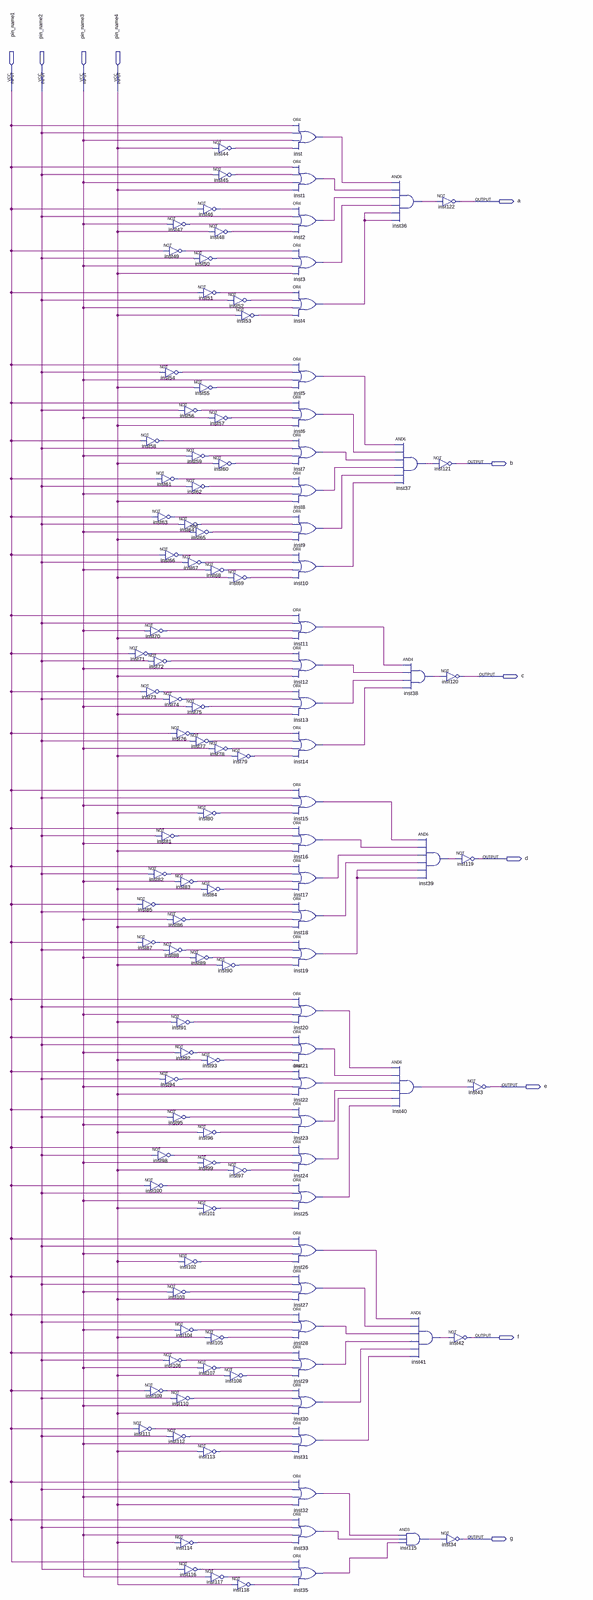
[diagram p0: schematic sheet, whole]
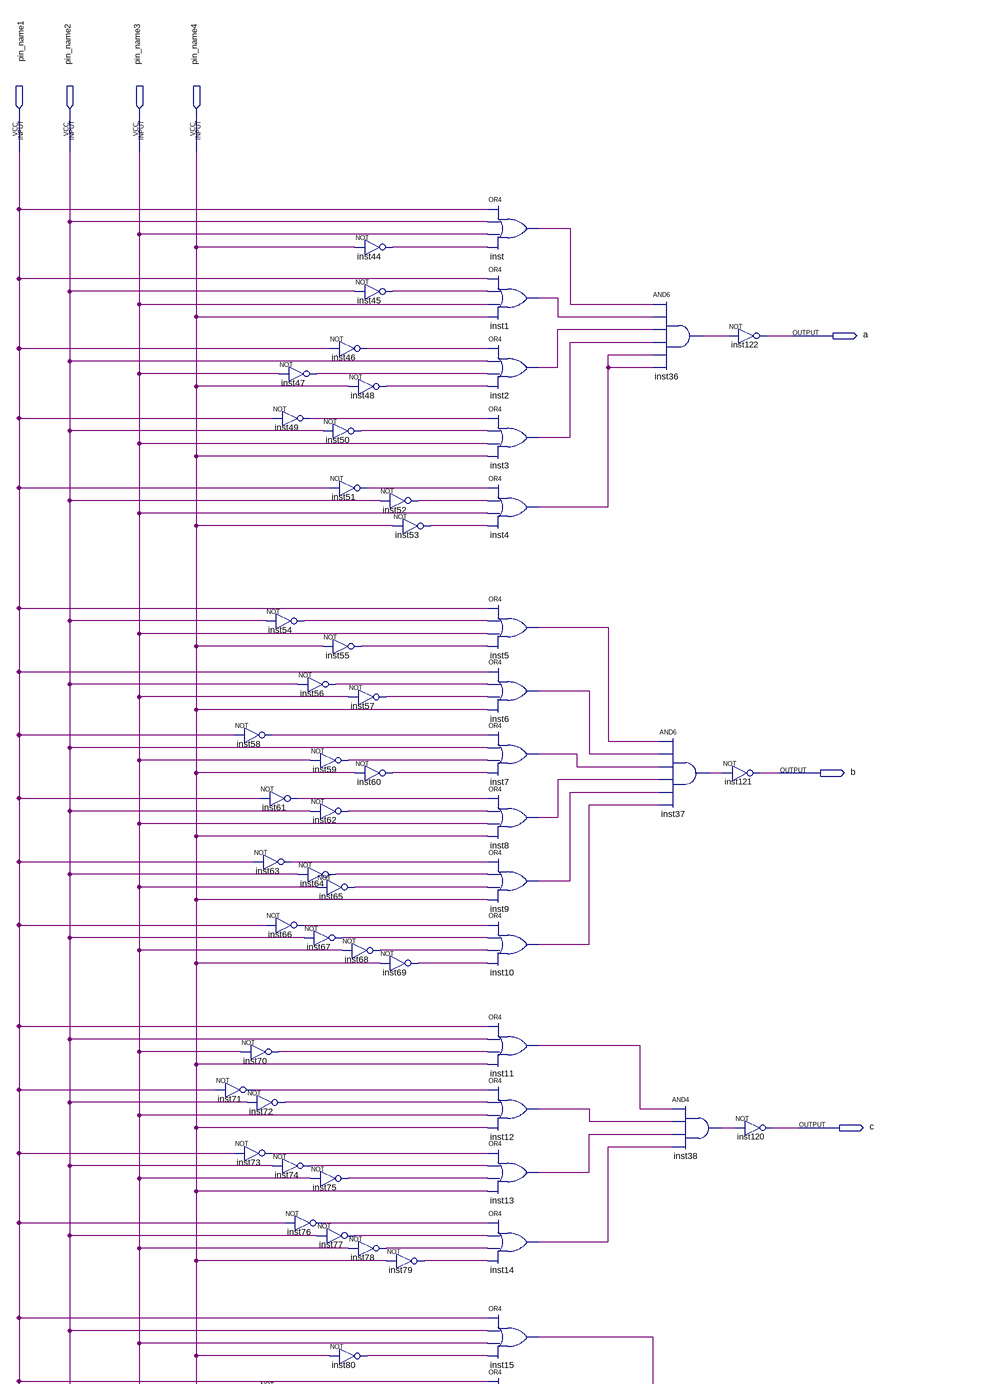
[diagram p1: schematic sheet, upper part]
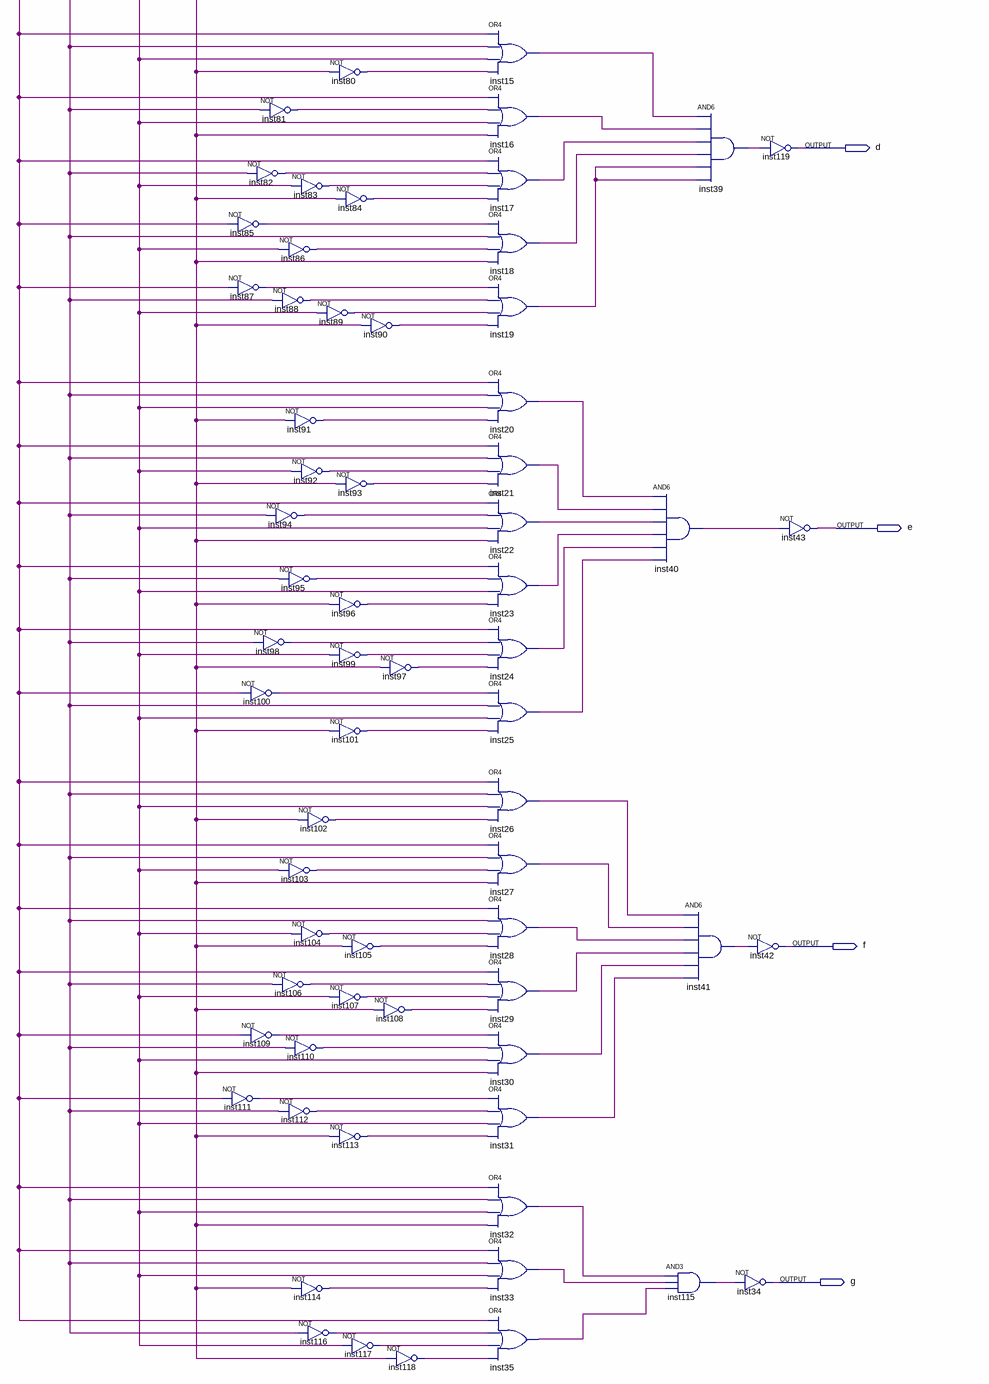
[diagram p2: schematic sheet, lower part]
// Quartus schematic aula04.bdf as structural Verilog: 123 symbols, 11 pins
module aula04 (
  input  pin_name1,
  input  pin_name2,
  input  pin_name3,
  input  pin_name4,
  output a,
  output b,
  output c,
  output d,
  output e,
  output f,
  output g
);

  wire inst1_out, inst2_out, inst3_out, inst4_out, inst5_out, inst6_out, inst7_out, inst8_out, inst9_out,
       inst10_out, inst11_out, inst12_out, inst13_out, inst14_out, inst15_out, inst16_out, inst17_out,
       inst18_out, inst19_out, inst20_out, inst21_out, inst22_out, inst23_out, inst24_out, inst25_out,
       inst26_out, inst27_out, inst28_out, inst29_out, inst30_out, inst31_out, inst32_out, inst33_out,
       inst35_out, inst36_out, inst37_out, inst38_out, inst39_out, inst40_out, inst41_out, inst44_out,
       inst45_out, inst46_out, inst47_out, inst48_out, inst49_out, inst50_out, inst51_out, inst52_out,
       inst53_out, inst54_out, inst55_out, inst56_out, inst57_out, inst58_out, inst59_out, inst60_out,
       inst61_out, inst62_out, inst63_out, inst64_out, inst65_out, inst66_out, inst67_out, inst68_out,
       inst69_out, inst70_out, inst71_out, inst72_out, inst73_out, inst74_out, inst75_out, inst76_out,
       inst77_out, inst78_out, inst79_out, inst80_out, inst81_out, inst82_out, inst83_out, inst84_out,
       inst85_out, inst86_out, inst87_out, inst88_out, inst89_out, inst90_out, inst91_out, inst92_out,
       inst93_out, inst94_out, inst95_out, inst96_out, inst97_out, inst98_out, inst99_out, inst100_out,
       inst101_out, inst102_out, inst103_out, inst104_out, inst105_out, inst106_out, inst107_out,
       inst108_out, inst109_out, inst110_out, inst111_out, inst112_out, inst113_out, inst114_out,
       inst115_out, inst116_out, inst117_out, inst118_out, inst_out;

  not inst58 (inst58_out, pin_name1);
  not inst63 (inst63_out, pin_name1);
  not inst70 (inst70_out, pin_name3);
  not inst71 (inst71_out, pin_name1);
  not inst72 (inst72_out, pin_name2);
  not inst73 (inst73_out, pin_name1);
  not inst82 (inst82_out, pin_name2);
  not inst85 (inst85_out, pin_name1);
  not inst87 (inst87_out, pin_name1);
  not inst98 (inst98_out, pin_name2);
  not inst100 (inst100_out, pin_name1);
  not inst109 (inst109_out, pin_name1);
  not inst111 (inst111_out, pin_name1);
  not inst47 (inst47_out, pin_name3);
  not inst49 (inst49_out, pin_name1);
  not inst54 (inst54_out, pin_name2);
  not inst56 (inst56_out, pin_name2);
  not inst61 (inst61_out, pin_name1);
  not inst64 (inst64_out, pin_name2);
  not inst66 (inst66_out, pin_name1);
  not inst67 (inst67_out, pin_name2);
  not inst74 (inst74_out, pin_name2);
  not inst76 (inst76_out, pin_name1);
  not inst81 (inst81_out, pin_name2);
  not inst83 (inst83_out, pin_name3);
  not inst86 (inst86_out, pin_name3);
  not inst88 (inst88_out, pin_name2);
  not inst91 (inst91_out, pin_name4);
  not inst92 (inst92_out, pin_name3);
  not inst94 (inst94_out, pin_name2);
  not inst95 (inst95_out, pin_name2);
  not inst102 (inst102_out, pin_name4);
  not inst103 (inst103_out, pin_name3);
  not inst104 (inst104_out, pin_name3);
  not inst106 (inst106_out, pin_name2);
  not inst110 (inst110_out, pin_name2);
  not inst112 (inst112_out, pin_name2);
  not inst114 (inst114_out, pin_name4);
  not inst116 (inst116_out, pin_name2);
  not inst44 (inst44_out, pin_name4);
  not inst45 (inst45_out, pin_name2);
  not inst46 (inst46_out, pin_name1);
  not inst48 (inst48_out, pin_name4);
  not inst50 (inst50_out, pin_name2);
  not inst51 (inst51_out, pin_name1);
  not inst55 (inst55_out, pin_name4);
  not inst57 (inst57_out, pin_name3);
  not inst59 (inst59_out, pin_name3);
  not inst60 (inst60_out, pin_name4);
  not inst62 (inst62_out, pin_name2);
  not inst65 (inst65_out, pin_name3);
  not inst68 (inst68_out, pin_name3);
  not inst75 (inst75_out, pin_name3);
  not inst77 (inst77_out, pin_name2);
  not inst78 (inst78_out, pin_name3);
  not inst80 (inst80_out, pin_name4);
  not inst84 (inst84_out, pin_name4);
  not inst89 (inst89_out, pin_name3);
  not inst93 (inst93_out, pin_name4);
  not inst96 (inst96_out, pin_name4);
  not inst99 (inst99_out, pin_name3);
  not inst101 (inst101_out, pin_name4);
  not inst105 (inst105_out, pin_name4);
  not inst107 (inst107_out, pin_name3);
  not inst113 (inst113_out, pin_name4);
  not inst117 (inst117_out, pin_name3);
  not inst52 (inst52_out, pin_name2);
  not inst53 (inst53_out, pin_name4);
  not inst69 (inst69_out, pin_name4);
  not inst79 (inst79_out, pin_name4);
  not inst90 (inst90_out, pin_name4);
  not inst97 (inst97_out, pin_name4);
  not inst108 (inst108_out, pin_name4);
  not inst118 (inst118_out, pin_name4);
  or inst (inst_out, pin_name1, pin_name2, pin_name3, inst44_out);
  or inst1 (inst1_out, pin_name1, inst45_out, pin_name3, pin_name4);
  or inst2 (inst2_out, inst46_out, pin_name2, inst47_out, inst48_out);
  or inst3 (inst3_out, inst49_out, inst50_out, pin_name3, pin_name4);
  or inst4 (inst4_out, inst51_out, inst52_out, pin_name3, inst53_out);
  or inst5 (inst5_out, pin_name1, inst54_out, pin_name3, inst55_out);
  or inst6 (inst6_out, pin_name1, inst56_out, inst57_out, pin_name4);
  or inst7 (inst7_out, inst58_out, pin_name2, inst59_out, inst60_out);
  or inst8 (inst8_out, inst61_out, inst62_out, pin_name3, pin_name4);
  or inst9 (inst9_out, inst63_out, inst64_out, inst65_out, pin_name4);
  or inst10 (inst10_out, inst66_out, inst67_out, inst68_out, inst69_out);
  or inst11 (inst11_out, pin_name1, pin_name2, inst70_out, pin_name4);
  or inst12 (inst12_out, inst71_out, inst72_out, pin_name3, pin_name4);
  or inst13 (inst13_out, inst73_out, inst74_out, inst75_out, pin_name4);
  or inst14 (inst14_out, inst76_out, inst77_out, inst78_out, inst79_out);
  or inst15 (inst15_out, pin_name1, pin_name2, pin_name3, inst80_out);
  or inst16 (inst16_out, pin_name1, inst81_out, pin_name3, pin_name4);
  or inst17 (inst17_out, pin_name1, inst82_out, inst83_out, inst84_out);
  or inst18 (inst18_out, inst85_out, pin_name2, inst86_out, pin_name4);
  or inst19 (inst19_out, inst87_out, inst88_out, inst89_out, inst90_out);
  or inst20 (inst20_out, pin_name1, pin_name2, pin_name3, inst91_out);
  or inst21 (inst21_out, pin_name1, pin_name2, inst92_out, inst93_out);
  or inst22 (inst22_out, pin_name1, inst94_out, pin_name3, pin_name4);
  or inst23 (inst23_out, pin_name1, inst95_out, pin_name3, inst96_out);
  or inst24 (inst24_out, pin_name1, inst98_out, inst99_out, inst97_out);
  or inst25 (inst25_out, inst100_out, pin_name2, pin_name3, inst101_out);
  or inst26 (inst26_out, pin_name1, pin_name2, pin_name3, inst102_out);
  or inst27 (inst27_out, pin_name1, pin_name2, inst103_out, pin_name4);
  or inst28 (inst28_out, pin_name1, pin_name2, inst104_out, inst105_out);
  or inst29 (inst29_out, pin_name1, inst106_out, inst107_out, inst108_out);
  or inst30 (inst30_out, inst109_out, inst110_out, pin_name3, pin_name4);
  or inst31 (inst31_out, inst111_out, inst112_out, pin_name3, inst113_out);
  or inst32 (inst32_out, pin_name1, pin_name2, pin_name3, pin_name4);
  or inst33 (inst33_out, pin_name1, pin_name2, pin_name3, inst114_out);
  or inst35 (inst35_out, pin_name1, inst116_out, inst117_out, inst118_out);
  and inst36 (inst36_out, inst_out, inst1_out, inst2_out, inst3_out, inst4_out, inst4_out);
  and inst37 (inst37_out, inst5_out, inst6_out, inst7_out, inst8_out, inst9_out, inst10_out);
  and inst40 (inst40_out, inst20_out, inst21_out, inst22_out, inst23_out, inst24_out, inst25_out);
  and inst38 (inst38_out, inst11_out, inst12_out, inst13_out, inst14_out);
  and inst39 (inst39_out, inst15_out, inst16_out, inst17_out, inst18_out, inst19_out, inst19_out);
  and inst41 (inst41_out, inst26_out, inst27_out, inst28_out, inst29_out, inst30_out, inst31_out);
  and inst115 (inst115_out, inst32_out, inst33_out, inst35_out);
  not inst122 (a, inst36_out);
  not inst121 (b, inst37_out);
  not inst120 (c, inst38_out);
  not inst119 (d, inst39_out);
  not inst42 (f, inst41_out);
  not inst34 (g, inst115_out);
  not inst43 (e, inst40_out);
endmodule
